# EAGLE schematic esp_all2 (EAGLE 7.6.0)
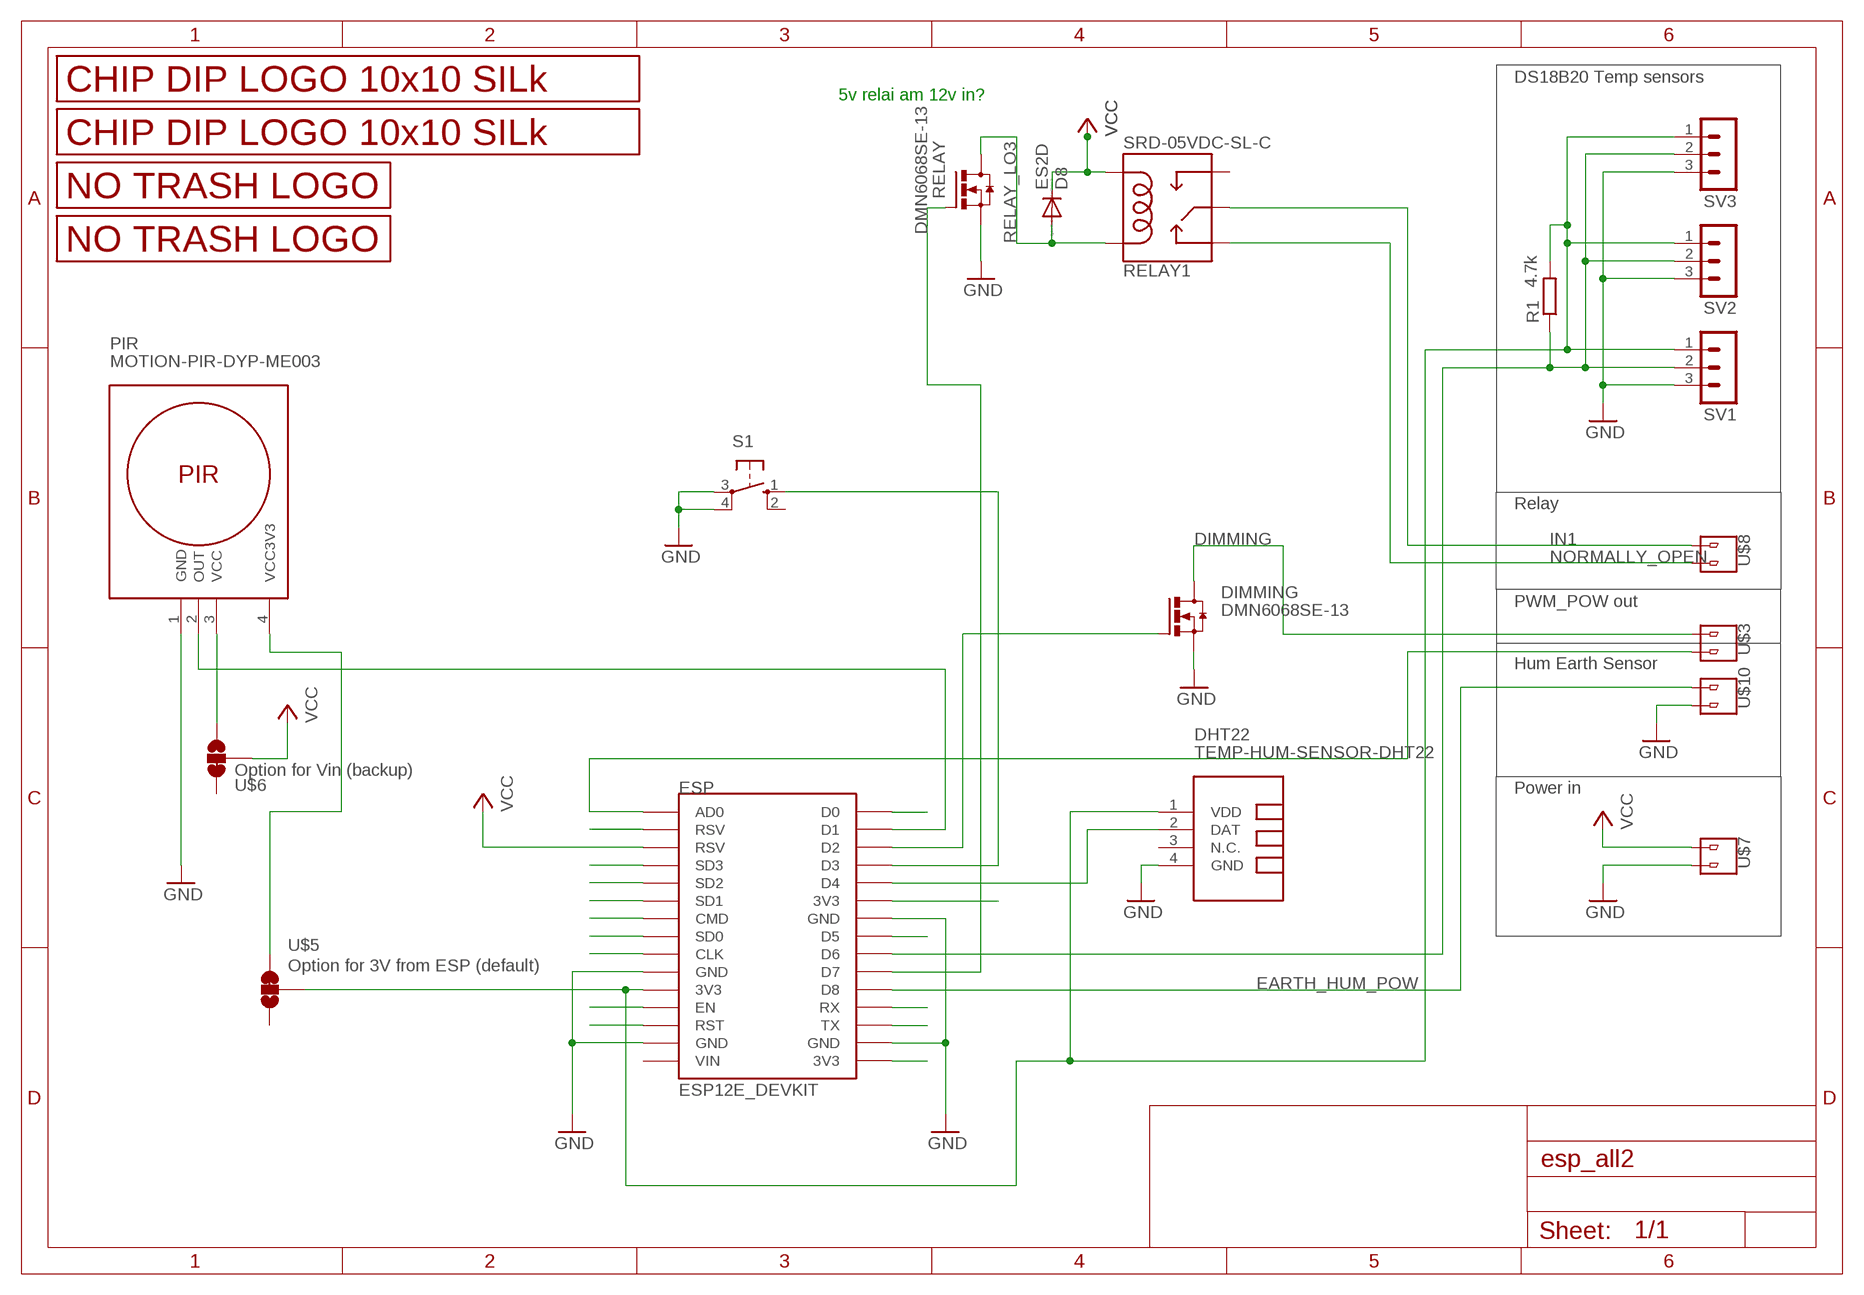
[diagram p0: schematic, sheet 1]

## Parts
D8  ES2D  DIODE-SMB  [SMB]
DHT22  TEMP-HUM-SENSOR-DHT22  [TEMP-HUM-SENSOR-DHT22]
DIMMING  DMN6068SE-13  NMOSFET_SMD_223  [SOT223]
ESP  ESP12E_DEVKIT  [ESP12E_DEVKIT]
PIR  MOTION-PIR-DYP-ME003  [MOTION-PIR-DYP-ME003]
R1  4.7k  R-EU_M0805  [M0805]
RELAY  DMN6068SE-13  NMOSFET_SMD_223  [SOT223]
RELAY1  SRD-05VDC-SL-C  RELAYPTH  [SRD-05VDC-SL-C]
S1  40/XX  [B3F/40XX]
SV1  MA03-1  [MA03-1]
SV2  MA03-1  [MA03-1]
SV3  MA03-1  [MA03-1]
U$1  LOGO_10X10_SILK  [LOGO2_10X10_SILK]
U$3  V1  2_PIN_CONNECTOR  [2_SCREW_PIN]
U$4  LOGO_NO_TRASHNO_TRASH  [LOGO_ROHS_NO_TRASH]
U$5  SMD_SJ_3WAY_CLOSED  [SMD_SJ_3WAY_CLOSED]
U$6  SMD_SJ_3WAY_CLOSED  [SMD_SJ_3WAY_CLOSED]
U$7  V1  2_PIN_CONNECTOR  [2_SCREW_PIN]
U$8  V1  2_PIN_CONNECTOR  [2_SCREW_PIN]
U$9  LOGO_NO_TRASHROHS  [LOGO_ROHS_SYM]
U$10  V1  2_PIN_CONNECTOR  [2_SCREW_PIN]
U$11  LOGO_10X10_SILK  [LOGO2_10X10_SILK]

## Nets
DIMMING: DIMMING.2(D) DIMMING.4(D) U$3.P$1
EARTH_HUM_POW: ESP.D8 ESP.D81(D8) U$10.P$1
GND: DHT22.4(GND) DIMMING.3(S) ESP.GND@0(GND) ESP.GND@1(GND) ESP.GND@2(GND) ESP.GND@3(GND) ESP.GND@4(GND) ESP.GND@5(GND) ESP.GND@6(GND) ESP.GND@7(GND) PIR.1(GND) RELAY.3(S) S1.3(P) S1.4(P1) SV1.3 SV2.3 SV3.3 U$7.P$2 U$10.P$2
IN1: RELAY1.SWCOMMON U$8.P$1
N$1: ESP.AD0 ESP.AD1(AD0) U$3.P$2
N$2: ESP.RSV@0(RSV) ESP.RSV@01(RSV)
N$3: ESP.3V3@1(3V3)
N$4: ESP.SD3 ESP.SD32(SD3)
N$5: ESP.SD2 ESP.SD22(SD2)
N$6: ESP.SD1 ESP.SD12(SD1)
N$7: ESP.CMD ESP.CMD1(CMD)
N$8: ESP.SD0 ESP.SD01(SD0)
N$9: ESP.CLK ESP.CLK1(CLK)
N$10: ESP.D7 ESP.D71(D7) RELAY.1(G)
N$11: ESP.3V3@2(3V3)
N$12: ESP.EN ESP.EN1(EN)
N$13: ESP.RST ESP.RST1(RST)
N$15: ESP.D6 ESP.D61(D6) R1.1 SV1.2 SV2.2 SV3.2
N$18: ESP.TX ESP.TX1(TX)
N$19: ESP.RX ESP.RX1(RX)
N$23: ESP.D5 ESP.D51(D5)
N$24: PIR.4(VCC3V3) U$5.1
N$25: DHT22.1(VDD) ESP.3V3@0(3V3) ESP.3V3@3(3V3) ESP.3V3@4(3V3) ESP.3V3@5(3V3) R1.2 SV1.1 SV2.1 SV3.1 U$5.2
N$26: DHT22.2(DAT) ESP.D4 ESP.D41(D4)
N$27: ESP.D3 ESP.D31(D3) S1.1(S)
N$28: DIMMING.1(G) ESP.D2 ESP.D21(D2)
N$29: ESP.D1 ESP.D11(D1) PIR.2(OUT)
N$30: ESP.D0 ESP.D01(D0)
N$31: PIR.3(VCC) U$6.3
NORMALLY_OPEN: RELAY1.SWCLOSED(SWCLOSE) U$8.P$2
RELAY_LO3: D8.A RELAY1.COIL1 RELAY.2(D) RELAY.4(D)
VCC: D8.C ESP.RSV@1(RSV) ESP.RSV@11(RSV) RELAY1.COIL0 U$6.2 U$7.P$1
Unconnected: DHT22.3(N.C.) ESP.VIN ESP.VIN1(VIN) RELAY1.SWOPEN S1.2(S1) U$5.3 U$6.1

## Notes on the sheet
- DS18B20 Temp sensors
- 5v relai am 12v in?
- Relay
- PWM_POW out
- Hum Earth Sensor
- Option for Vin (backup)
- Power in
- Option for 3V from ESP (default)

## Library data of the parts
D8 = diode:DIODE-: DIODE
DHT22 = diy-modules:TEMP-HUM-SENSOR-DHT22: DHT22 - digital humidity & temperature sensor Also known as: AM2302 AM2302 datasheet available here: http://akizukidenshi.com/download/ds/aosong/AM2302.pdf Click here to find device on ebay.com <http://www.ebay.com/sch/dht22+digital+sensor>
DIMMING RELAY = transistor-power:NMOSFET_SMD_223
ESP = ESP12E_DEVKIT:ESP12E_DEVKIT: ESP12E DEVKIT BOARD
PIR = diy-modules:MOTION-PIR-DYP-ME003: PIR Motion Sensor Module DYP-ME003 based on BISS0001 pyroelectic detector Click here to find device on ebay.com <http://www.ebay.com/sch/dyp+me003>
R1 = rcl:R-EU_: RESISTOR, European symbol
RELAY1 = JKW_CHIP:RELAY: SPDT relay (COM-00101)
S1 = switch-omron:40/XX: OMRON SWITCH; OC_FARNELL: unknown; OC_NEWARK: unknown
SV1-SV3 = con-lstb:MA03-1: PIN HEADER; OC_FARNELL: unknown; OC_NEWARK: unknown
U$1 U$11 = JKW_CHIP:LOGO_10X10_SILK
U$3 U$7 U$8 U$10 = JKW_CHIP:2_PIN_CONNECTOR
U$4 U$9 = JKW_CHIP:LOGO_NO_TRASH
U$5 U$6 = JKW_CHIP:SMD_SJ_3WAY_CLOSED